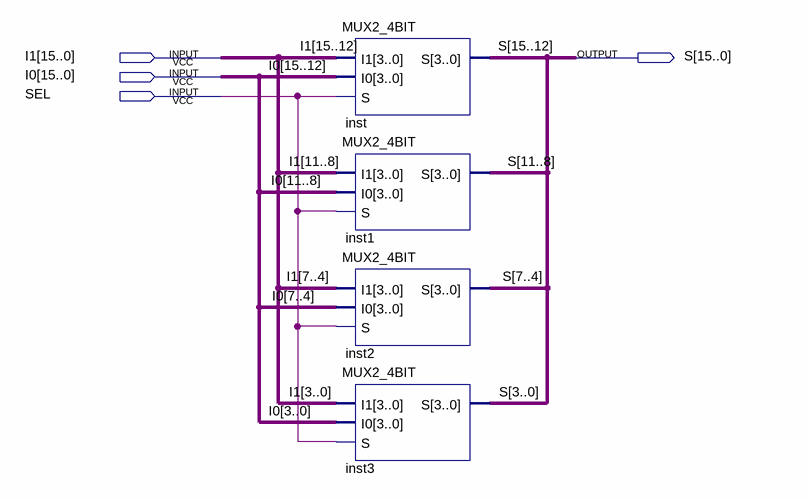
[diagram p0: schematic sheet]
// Quartus schematic MUX2_14BIT.bdf as structural Verilog: 4 symbols, 4 pins
module MUX2_14BIT (
  input  [15:0] I1,
  input  [15:0] I0,
  input  SEL,
  output [15:0] S
);

  MUX2_4BIT inst (.I1(I1[15:12]), .I0(I0[15:12]), .S({S[15:13], SEL, S[12]}));
  MUX2_4BIT inst1 (.I1(I1[11:8]), .I0(I0[11:8]), .S({S[11:9], SEL, S[8]}));
  MUX2_4BIT inst2 (.I1(I1[7:4]), .I0(I0[7:4]), .S({S[7:5], SEL, S[4]}));
  MUX2_4BIT inst3 (.I1(I1[3:0]), .I0(I0[3:0]), .S({S[3:1], SEL, S[0]}));
endmodule
